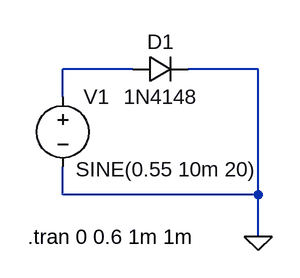
[diagram p0: schematic diode.asc]
diode.asc, the LTspice schematic file:
Version 4.1
SHEET 1 880 680
WIRE 144 -16 64 -16
WIRE 288 -16 208 -16
WIRE 64 16 64 -16
WIRE 64 128 64 96
WIRE 288 128 288 -16
WIRE 288 128 64 128
WIRE 288 176 288 128
FLAG 288 176 0
SYMBOL diode 144 0 R270
WINDOW 0 32 32 VTop 2
WINDOW 3 0 32 VBottom 2
SYMATTR InstName D1
SYMATTR Value 1N4148
SYMBOL voltage 64 0 R0
WINDOW 123 24 124 Left 2
WINDOW 39 24 124 Left 2
WINDOW 3 15 99 Left 2
SYMATTR InstName V1
SYMATTR Value SINE(0.55 10m 20)
TEXT 24 176 Left 2 !.tran 0 0.6 1m 1m

The netlist it stands for:
* diode.asc
D1 N001 0 1N4148
V1 N001 0 SINE(0.55 10m 20)
.model D D
.lib standard.dio
.tran 0 0.6 1m 1m
.backanno
.end